# EAGLE schematic gigbrain_chan (EAGLE 6.1)
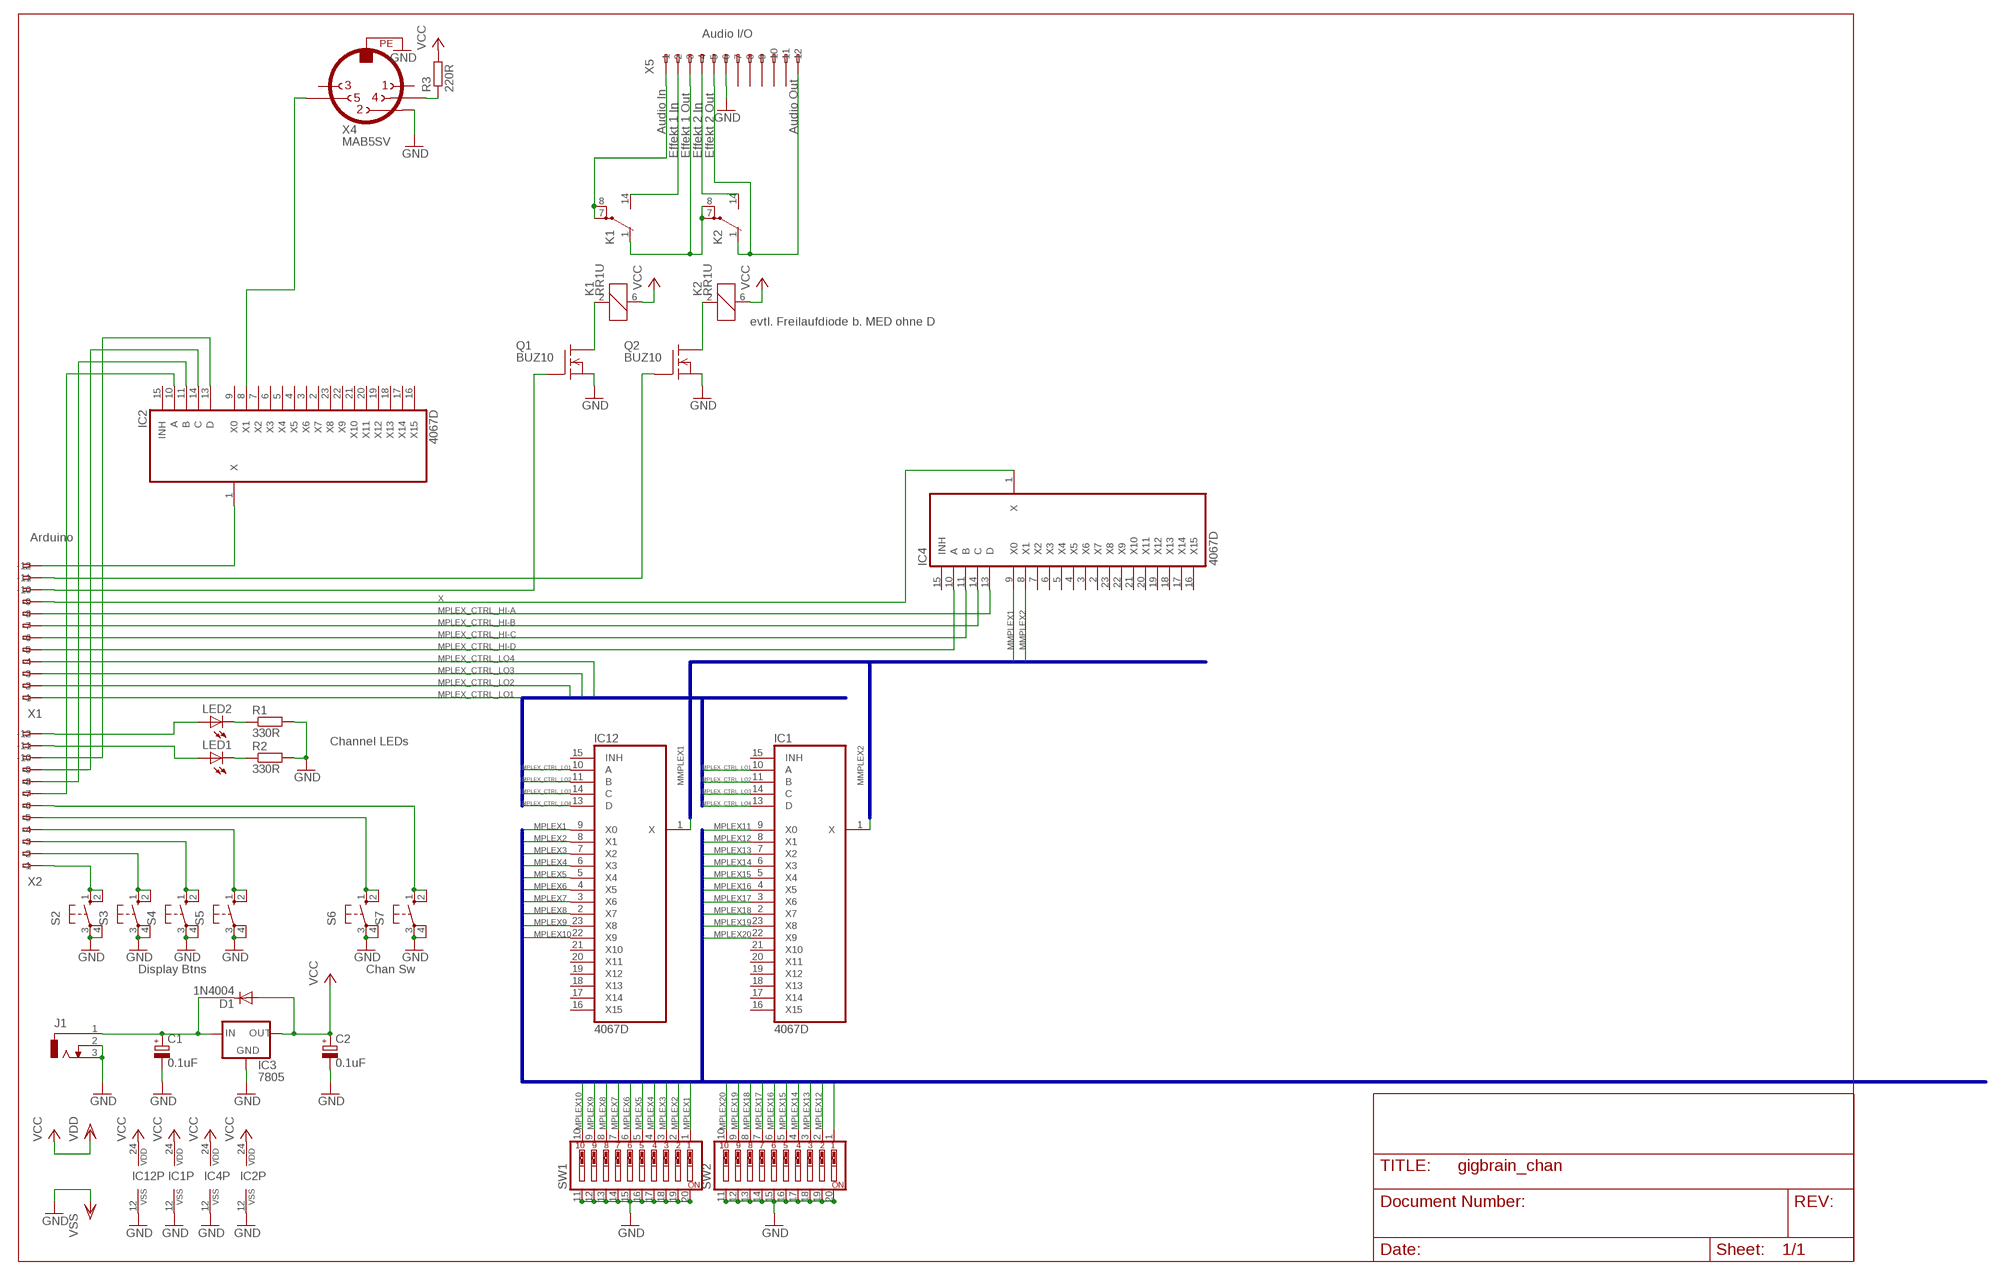
[diagram p0: schematic, sheet 1]

## Parts
C1  0.1uF  CPOL-EUE2.5-5  [E2,5-5]
C2  0.1uF  CPOL-EUE2.5-5  [E2,5-5]
D1  1N4004  [DO41-10]
IC1  4067D  [SO24W]
IC2  4067D  [SO24W]
IC3  7805  78XXL  [78XXL]
IC4  4067D  [SO24W]
IC12  4067D  [SO24W]
J1  DCJ0303  [DCJ0303]
K1  RR1U  [RR1U]
K2  RR1U  [RR1U]
LED1  LED3MM  [LED3MM]
LED2  LED3MM  [LED3MM]
Q1  BUZ10  [TO220]
Q2  BUZ10  [TO220]
R1  330R  R-EU_0204/7  [0204/7]
R2  330R  R-EU_0204/7  [0204/7]
R3  220R  R-EU_0207/10  [0207/10]
S2  10-XX  [B3F-10XX]
S3  10-XX  [B3F-10XX]
S4  10-XX  [B3F-10XX]
S5  10-XX  [B3F-10XX]
S6  10-XX  [B3F-10XX]
S7  10-XX  [B3F-10XX]
SW1  SW_DIP-10  [EDG-10]
SW2  SW_DIP-10  [EDG-10]
X1  233-512  [233-512]
X2  233-512  [233-512]
X4  MAB5SV  [MAB5SV]
X5  233-512  [233-512]

## Nets
GND: C1.- C2.- IC1.12(VSS) IC2.12(VSS) IC3.GND IC4.12(VSS) IC12.12(VSS) J1.2 J1.3 Q1.3(S) Q2.3(S) R1.2 R2.2 S2.3(P) S2.4(P1) S3.3(P) S3.4(P1) S4.3(P) S4.4(P1) S5.3(P) S5.4(P1) S6.3(P) S6.4(P1) S7.3(P) S7.4(P1) SW1.11 SW1.12 SW1.13 SW1.14 SW1.15 SW1.16 SW1.17 SW1.18 SW1.19 SW1.20 SW2.11 SW2.12 SW2.13 SW2.14 SW2.15 SW2.16 SW2.17 SW2.18 SW2.19 SW2.20 X4.2 X4.PE X5.A6(-6) X5.B6(B-6) ; supply symbol labelled VSS
MMPLEX1: IC4.9(X0) IC12.1(X)
MMPLEX2: IC1.1(X) IC4.8(X1)
MPLEX1: IC12.9(X0) SW1.1
MPLEX2: IC12.8(X1) SW1.2
MPLEX3: IC12.7(X2) SW1.3
MPLEX4: IC12.6(X3) SW1.4
MPLEX5: IC12.5(X4) SW1.5
MPLEX6: IC12.4(X5) SW1.6
MPLEX7: IC12.3(X6) SW1.7
MPLEX8: IC12.2(X7) SW1.8
MPLEX9: IC12.23(X8) SW1.9
MPLEX10: IC12.22(X9) SW1.10
MPLEX11: IC1.9(X0) SW2.1
MPLEX12: IC1.8(X1) SW2.2
MPLEX13: IC1.7(X2) SW2.3
MPLEX14: IC1.6(X3) SW2.4
MPLEX15: IC1.5(X4) SW2.5
MPLEX16: IC1.4(X5) SW2.6
MPLEX17: IC1.3(X6) SW2.7
MPLEX18: IC1.2(X7) SW2.8
MPLEX19: IC1.23(X8) SW2.9
MPLEX20: IC1.22(X9) SW2.10
MPLEX_CTRL_LO1: IC1.10(A) IC12.10(A) X1.A1(-1) X1.B1(B-1)
MPLEX_CTRL_LO2: IC1.11(B) IC12.11(B) X1.A2(-2) X1.B2(B-2)
MPLEX_CTRL_LO3: IC1.14(C) IC12.14(C) X1.A3(-3) X1.B3(B-3)
MPLEX_CTRL_LO4: IC1.13(D) IC12.13(D) X1.A4(-4) X1.B4(B-4)
N$1: IC4.10(A) X1.A5(-5) X1.B5(B-5)
N$2: IC4.11(B) X1.A6(-6) X1.B6(B-6)
N$3: IC4.14(C) X1.A7(-7) X1.B7(B-7)
N$4: IC4.13(D) X1.A8(-8) X1.B8(B-8)
N$5: C1.+ D1.C IC3.IN J1.1
N$6: IC2.8(X1) X4.5
N$7: S2.1(S) S2.2(S1) X2.A1(-1) X2.B1(B-1)
N$8: S3.1(S) S3.2(S1) X2.A2(-2) X2.B2(B-2)
N$9: S4.1(S) S4.2(S1) X2.A3(-3) X2.B3(B-3)
N$10: S5.1(S) S5.2(S1) X2.A4(-4) X2.B4(B-4)
N$11: S6.1(S) S6.2(S1) X2.A5(-5) X2.B5(B-5)
N$12: S7.1(S) S7.2(S1) X2.A6(-6) X2.B6(B-6)
N$14: R3.1 X4.4
N$16: IC2.1(X) X1.A12(-12) X1.B12(B-12)
N$17: IC2.10(A) X2.A7(-7) X2.B7(B-7)
N$18: IC2.11(B) X2.A8(-8) X2.B8(B-8)
N$19: K2.1(2:O) X5.A5(-5) X5.A12(-12) X5.B5(B-5) X5.B12(B-12)
N$20: Q1.1(G) X1.A10(-10) X1.B10(B-10)
N$21: IC2.14(C) X2.A9(-9) X2.B9(B-9)
N$22: IC2.13(D) X2.A10(-10) X2.B10(B-10)
N$23: K1.2 Q1.2(D)
N$24: K2.2 Q2.2(D)
N$25: LED2.A X2.A12(-12) X2.B12(B-12)
N$26: LED1.A X2.A11(-11) X2.B11(B-11)
N$27: Q2.1(G) X1.A11(-11) X1.B11(B-11)
N$28: K1.7(2:P) K1.8(2:P) X5.A1(-1) X5.B1(B-1)
N$29: K1.1(2:O) K2.7(2:P) K2.8(2:P) X5.A3(-3) X5.B3(B-3)
N$30: K1.14(2:S) X5.A2(-2) X5.B2(B-2)
N$31: K2.14(2:S) X5.A4(-4) X5.B4(B-4)
N$32: LED2.K(C) R1.1
N$33: LED1.K(C) R2.1
VCC: C2.+ D1.A IC1.24(VDD) IC2.24(VDD) IC3.OUT IC4.24(VDD) IC12.24(VDD) K1.6 K2.6 R3.2 ; supply symbol labelled VDD
X: IC4.1(X) X1.A9(-9) X1.B9(B-9)
Unconnected: IC1.15(INH) IC1.16(X15) IC1.17(X14) IC1.18(X13) IC1.19(X12) IC1.20(X11) IC1.21(X10) IC2.2(X7) IC2.3(X6) IC2.4(X5) IC2.5(X4) IC2.6(X3) IC2.7(X2) IC2.9(X0) IC2.15(INH) IC2.16(X15) IC2.17(X14) IC2.18(X13) IC2.19(X12) IC2.20(X11) IC2.21(X10) IC2.22(X9) IC2.23(X8) IC4.2(X7) IC4.3(X6) IC4.4(X5) IC4.5(X4) IC4.6(X3) IC4.7(X2) IC4.15(INH) IC4.16(X15) IC4.17(X14) IC4.18(X13) IC4.19(X12) IC4.20(X11) IC4.21(X10) IC4.22(X9) IC4.23(X8) IC12.15(INH) IC12.16(X15) IC12.17(X14) IC12.18(X13) IC12.19(X12) IC12.20(X11) IC12.21(X10) X4.1 X4.3 X5.A7(-7) X5.A8(-8) X5.A9(-9) X5.A10(-10) X5.A11(-11) X5.B7(B-7) X5.B8(B-8) X5.B9(B-9) X5.B10(B-10) X5.B11(B-11)

## Buses
MPLEX[1..160]
MPLEX_CTRL_LO[1..4]
MMPLEX[1..10]

## Notes on the sheet
- Audio I/O
- Audio In | Audio Out
- Effekt 1 In | Effekt 1 Out | Effekt 2 In | Effekt 2 Out
- evtl. Freilaufdiode b. MED ohne D
- Arduino
- X
- MPLEX_CTRL_HI-A
- MPLEX_CTRL_HI-B
- MPLEX_CTRL_HI-C
- MPLEX_CTRL_HI-D
- Channel LEDs
- Display Btns | Chan Sw

## Library data of the parts
C1 C2 = rcl:CPOL-EU: POLARIZED CAPACITOR, European symbol
D1 = diode:1N4004: DIODE general purpose rectifier, 1 A
IC1 IC2 IC4 IC12 = gigbrain_parts:4067: 16-channel ANALOG MULTIPLEXER
IC3 = v-reg:78XXL: VOLTAGE REGULATOR
J1 = con-jack:DCJ0303: DC POWER JACK Source: DCJ0303.pdf
K1 K2 = relay:RR1U: RELAY reed, polarity, 1 x switch with shield
LED1 LED2 = led:LED: LED OSRAM: - CHIPLED LG R971, LG N971, LY N971, LG Q971, LY Q971, LO R971, LY R971 LH N974, LH R974 LS Q976, LO Q976, LY Q976 LO Q996 - Hyper CHIPLED LW Q18S LB Q993, LB Q99A, LB R99A - SideLED LS A670, LO A670, LY A670, LG A670, LP A670 LB A673, LV A673, LT A673, LW A673 LH A674 LY A675 LS A676, LA A676, LO A676, LY A676, LW A676 LS A679, LY A679, LG A679 - Hyper Micro SIDELED® LS Y876, LA Y876, LO Y876, LY Y876 LT Y87S - SmartLED LW L88C, LW L88S LB L89C, LB L89S, LG L890 LS L89K, LO L89K, LY L89K LS L896, LA L896, LO L896, LY L896 - TOPLED LS T670, LO T670, LY T670, LG T670, LP T670 LSG T670, LSP T670, LSY T670, LOP T670, LYG T670 LG T671, LOG T671, LSG T671 LB T673, LV T673, LT T673, LW T673 LH T674 LS T676, LA T676, LO T676, LY T676, LB T676, LH T676, LSB T676, LW T676 LB T67C, LV T67C, LT T67C, LS T67K, LO T67K, LY T67K, LW E67C LS E67B, LA E67B, LO E67B, LY E67B, LB E67C, LV E67C, LT E67C LW T67C LS T679, LY T679, LG T679 LS T770, LO T770, LY T770, LG T770, LP T770 LB T773, LV T773, LT T773, LW T773 LH T774 LS E675, LA E675, LY E675, LS T675 LS T776, LA T776, LO T776, LY T776, LB T776 LHGB T686 LT T68C, LB T68C - Hyper Mini TOPLED® LB M676 - Mini TOPLED Santana® LG M470 LS M47K, LO M47K, LY M47K Source: http://www.osram.convergy.de LUXEON: - LUMILED® LXK2-PW12-R00, LXK2-PW12-S00, LXK2-PW14-U00, LXK2-PW14-V00 LXK2-PM12-R00, LXK2-PM12-S00, LXK2-PM14-U00 LXK2-PE12-Q00, LXK2-PE12-R00, LXK2-PE12-S00, LXK2-PE14-T00, LXK2-PE14-U00 LXK2-PB12-K00, LXK2-PB12-L00, LXK2-PB12-M00, LXK2-PB14-N00, LXK2-PB14-P00, LXK2-PB14-Q00 LXK2-PR12-L00, LXK2-PR12-M00, LXK2-PR14-Q00, LXK2-PR14-R00 LXK2-PD12-Q00, LXK2-PD12-R00, LXK2-PD12-S00 LXK2-PH12-R00, LXK2-PH12-S00 LXK2-PL12-P00, LXK2-PL12-Q00, LXK2-PL12-R00 Source: www.luxeon.com KINGBRIGHT: KA-3528ASYC Source: www.kingbright.com
Q1 Q2 = transistor-fet:BUZ10: N-Channel Enhancement MOSFET 50V; 20A; 0,080Ohm
R1-R3 = rcl:R-EU_: RESISTOR, European symbol
S2-S7 = switch-omron:10-XX: OMRON SWITCH
SW1 SW2 = special:SW_DIP-10: DIP SWITCH
X1 X2 X5 = con-wago:233-512: WAGO Cage Clamp
X4 = con-hirschmann:MAB5SV: Female CONNECTOR 5 pins 90 deg. with shield, vertical (DIN41524)